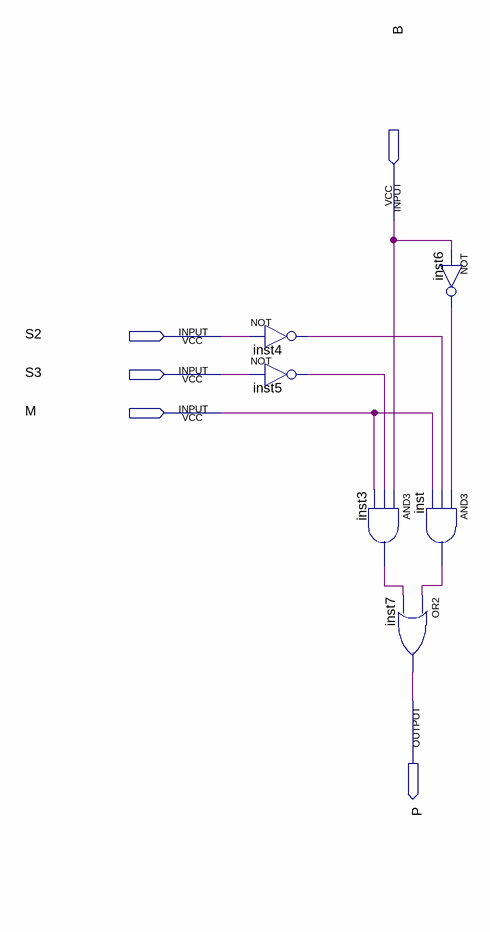
[diagram p0: schematic sheet]
// Quartus schematic AE.bdf as structural Verilog: 6 symbols, 5 pins
module AE (
  input  B,
  input  S2,
  input  S3,
  input  M,
  output P
);

  wire inst3_out, inst4_out, inst5_out, inst6_out, inst_out;

  not inst4 (inst4_out, S2);
  not inst5 (inst5_out, S3);
  and inst (inst_out, inst6_out, inst4_out, M);
  and inst3 (inst3_out, B, inst5_out, M);
  or inst7 (P, inst_out, inst3_out);
  not inst6 (inst6_out, B);
endmodule
